# EAGLE design xmega32A4U (EAGLE 6.5.0)
DATABASE: /Users/jmoreland/.dropbox-alt/Dropbox/eagle/JCM-Eagle/bom/PARTSDB.TXT; DRAWN: Joseph Moreland
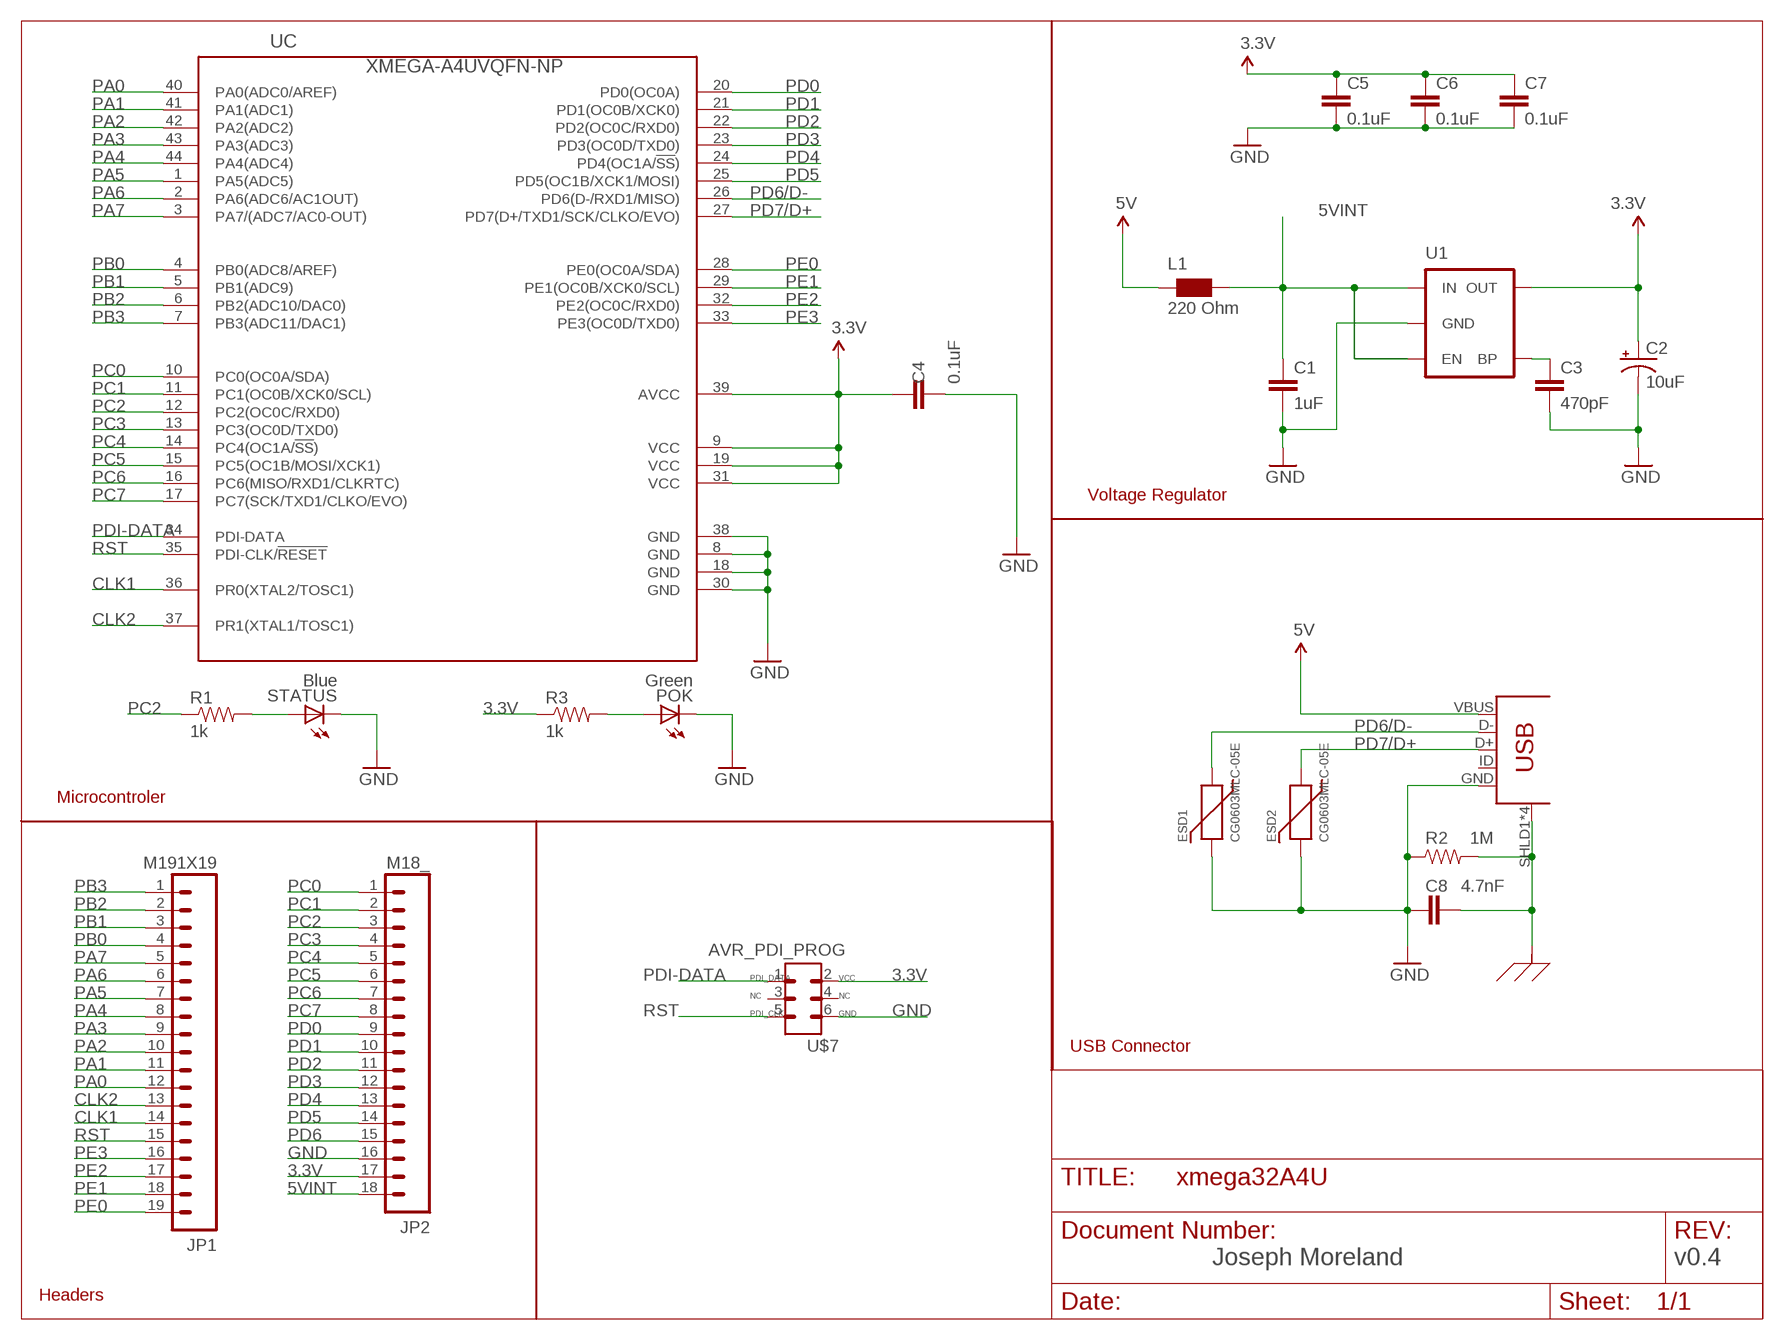
[diagram p0: schematic, sheet 1]

## Parts
C1  1uF  CAP0603-CAP  [0603-CAP]
C2  10uF  CAP_POL1206  [EIA3216]
C3  470pF  CAP0603-CAP  [0603-CAP]
C4  0.1uF  CAP0402-CAP  [0402-CAP]
C5  0.1uF  CAP0402-CAP  [0402-CAP]
C6  0.1uF  CAP0402-CAP  [0402-CAP]
C7  0.1uF  CAP0402-CAP  [0402-CAP]
C8  4.7nF  CAP0402-CAP  [0402-CAP]
ESD1  CG0603MLC-05E  CG0603MLC  [0603-CHIPGUARD]
ESD2  CG0603MLC-05E  CG0603MLC  [0603-CHIPGUARD]
JP1  M191X19  [1X19]
JP2  M18_  [1X18]
L1  220 Ohm  WE-CBF_0603  [0603]
POK  Green  LED0603  [LED-0603]
R1  1k  RESISTOR0603-RES  [0603-RES]
R2  1M  RESISTOR0402-RES  [0402-RES]
R3  1k  RESISTOR0603-RES  [0603-RES]
STATUS  Blue  LED0603  [LED-0603]
U1  V_REG_MIC52193.3V  [SOT23-5]
U$4  USB-MINIB  [USB-MINI-B-UX60-MB-5S8]
U$7  AVR_PDI_PROG  [AVR_50MIL_PROG]
UC  XMEGA-A4UVQFN-NP  [QFN44-NOPAD]

## Nets
3.3V: C2.A(+) C4.1 C5.1 C6.1 C7.1 JP2.17 R3.1 U1.5(OUT) U$7.2(VCC) UC.9(VCC) UC.19(VCC) UC.31(VCC) UC.39(AVCC)
5V: L1.1 U$4.VBUS
5VINT: C1.1 JP2.18 L1.2 U1.1(IN) U1.3(EN)
CLK1: JP1.14 UC.36(PR0(XTAL2/TOSC1))
CLK2: JP1.13 UC.37(PR1(XTAL1/TOSC1))
GND: C1.2 C2.C(-) C3.2 C4.2 C5.2 C6.2 C7.2 C8.1 ESD1.P$1 ESD2.P$1 JP2.16 POK.C R2.1 STATUS.C U1.2(GND) U$4.GND U$7.6(GND) UC.8(GND) UC.18(GND) UC.30(GND) UC.38(GND)
N$1: POK.A R3.2
N$2: R1.2 STATUS.A
N$3: C3.1 U1.4(BP)
PA0: JP1.12 UC.40(PA0(ADC0/AREF))
PA1: JP1.11 UC.41(PA1(ADC1))
PA2: JP1.10 UC.42(PA2(ADC2))
PA3: JP1.9 UC.43(PA3(ADC3))
PA4: JP1.8 UC.44(PA4(ADC4))
PA5: JP1.7 UC.1(PA5(ADC5))
PA6: JP1.6 UC.2(PA6(ADC6/AC1OUT))
PA7: JP1.5 UC.3(PA7/(ADC7/AC0-OUT))
PB0: JP1.4 UC.4(PB0(ADC8/AREF))
PB1: JP1.3 UC.5(PB1(ADC9))
PB2: JP1.2 UC.6(PB2(ADC10/DAC0))
PB3: JP1.1 UC.7(PB3(ADC11/DAC1))
PC0: JP2.1 UC.10(PC0(OC0A/SDA))
PC1: JP2.2 UC.11(PC1(OC0B/XCK0/SCL))
PC2: JP2.3 R1.1 UC.12(PC2(OC0C/RXD0))
PC3: JP2.4 UC.13(PC3(OC0D/TXD0))
PC4: JP2.5 UC.14(PC4(OC1A/!SS!))
PC5: JP2.6 UC.15(PC5(OC1B/MOSI/XCK1))
PC6: JP2.7 UC.16(PC6(MISO/RXD1/CLKRTC))
PC7: JP2.8 UC.17(PC7(SCK/TXD1/CLKO/EVO))
PD0: JP2.9 UC.20(PD0(OC0A))
PD1: JP2.10 UC.21(PD1(OC0B/XCK0))
PD2: JP2.11 UC.22(PD2(OC0C/RXD0))
PD3: JP2.12 UC.23(PD3(OC0D/TXD0))
PD4: JP2.13 UC.24(PD4(OC1A/!SS!))
PD5: JP2.14 UC.25(PD5(OC1B/XCK1/MOSI))
PD6: JP2.15
PD6/D-: ESD1.P$2 U$4.D- UC.26(PD6(D-/RXD1/MISO))
PD7/D+: ESD2.P$2 U$4.D+ UC.27(PD7(D+/TXD1/SCK/CLKO/EVO))
PDI-DATA: U$7.1(PDI_DATA) UC.34(PDI-DATA)
PE0: JP1.19 UC.28(PE0(OC0A/SDA))
PE1: JP1.18 UC.29(PE1(OC0B/XCK0/SCL))
PE2: JP1.17 UC.32(PE2(OC0C/RXD0))
PE3: JP1.16 UC.33(PE3(OC0D/TXD0))
RST: JP1.15 U$7.5(PDI_CLK) UC.35(PDI-CLK/!RESET)
SHLD: C8.2 R2.2 U$4.SHLD1(SHLD) U$4.SHLD2(SHLD) U$4.SHLD3(SHLD) U$4.SHLD4(SHLD) ; supply symbol labelled GND_EARTH
Unconnected: U$4.ID U$7.3(NC) U$7.4(NC1)

## Notes on the sheet
- Voltage Regulator
- Microcontroler
- USB Connector
- Joseph Moreland | v0.4
- Headers

## Library data of the parts
C1 = JCM-Capacitors:CAP: Capacitor Standard 0603 ceramic capacitor, and 0.1" leaded capacitor.; PARTNO: C0603C105K3PACTU
C2 = SparkFun-Capacitors:CAP_POL: Capacitor Polarized These are standard SMD and PTH capacitors. Normally 10uF, 47uF, and 100uF in electrolytic and tantalum varieties. Always verify the external diameter of the through hole cap, it varies with capacity, voltage, and manufacturer. The EIA devices should be standard.; PARTNO: T494A106M020AT
C3 = JCM-Capacitors:CAP: Capacitor Standard 0603 ceramic capacitor, and 0.1" leaded capacitor.; PARTNO: C0603C471K5RACTU
C4-C7 = JCM-Capacitors:CAP: Capacitor Standard 0603 ceramic capacitor, and 0.1" leaded capacitor.; PARTNO: GMK105BJ104KV-F
C8 = JCM-Capacitors:CAP: Capacitor Standard 0603 ceramic capacitor, and 0.1" leaded capacitor.; PARTNO: C0402C472K3RACTU
ESD1 ESD2 = JCM:CG0603MLC: ESD suppresor ChipGuard MLC; PARTNO: CG0603MLC-05E
JP1 = SparkFun-Connectors:M19: 1x19 .1" header; PARTNO: M20-9732046
JP2 = SparkFun-Connectors:M18: 1x18 .1" header; PARTNO: 68000-418HLF
L1 = wuerth-elektronik:WE-CBF: SMD EMI Suppression Ferrite Beads - excellent anti-EMI properties - low DCR - impedances till 3000 ohms - rated current up to 6 A; PARTNO: MPZ1608S221A
POK = SparkFun-LED:LED: LEDs Standard schematic elements and footprints for 5mm, 3mm, 1206, and 0603 sized LEDs. 5mm - Spark Fun Electronics SKU : COM-00529 (and others); PARTNO: LTST-C190KGKT
R1 R3 = JCM-Resistors:RESISTOR: Resistor Basic schematic elements and footprints for 0603, 1206, and PTH resistors.; PARTNO: RC0603FR-071KL
R2 = JCM-Resistors:RESISTOR: Resistor Basic schematic elements and footprints for 0603, 1206, and PTH resistors.; PARTNO: CRCW04021M00JNED
STATUS = SparkFun-LED:LED: LEDs Standard schematic elements and footprints for 5mm, 3mm, 1206, and 0603 sized LEDs. 5mm - Spark Fun Electronics SKU : COM-00529 (and others); PARTNO: LTST-C191TBKT
U1 = SparkFun-PowerIC:V_REG_MIC5219: V_REG MIC5219 Standard 500mA LDO voltage regulator in SOT-23 layout. Micrel part MIC5219. BP (by-pass) pin is used to lower output noise with 470pF cap, may be left open.; PARTNO: MIC5219-3.3YM5 TR; PROD_ID: VREG-09872; VALUE: MIC5219 3.3V
U$4 = JCM-Connectors:USB-MINIB: Mini-USB "B" connector with 5th pin broken out. Created new symbol breaking out 5th "ID" pin in mini/micro USB connector spec. See: http://en.wikipedia.org/wiki/Mini_usb#Cables. Uses same footprint as 4-pin symbol. Also added pins to connect to mounting / shield pads if required (probably not generally needed as signals aren't shielded once they leave the connector).; PARTNO: UX60-MB-5S8
U$7 = JCM-Connectors:AVR_PDI_PROG; PARTNO: LPPB032NFSP-RC
UC = JCM-IC:XMEGA-A4U: Atmel XMega A4 series processor; PARTNO: ATXMEGA32A4U-MH

## Net classes
0 default: width 0.203 mm, drill 0.305 mm, clearance 0.203 mm

## Board
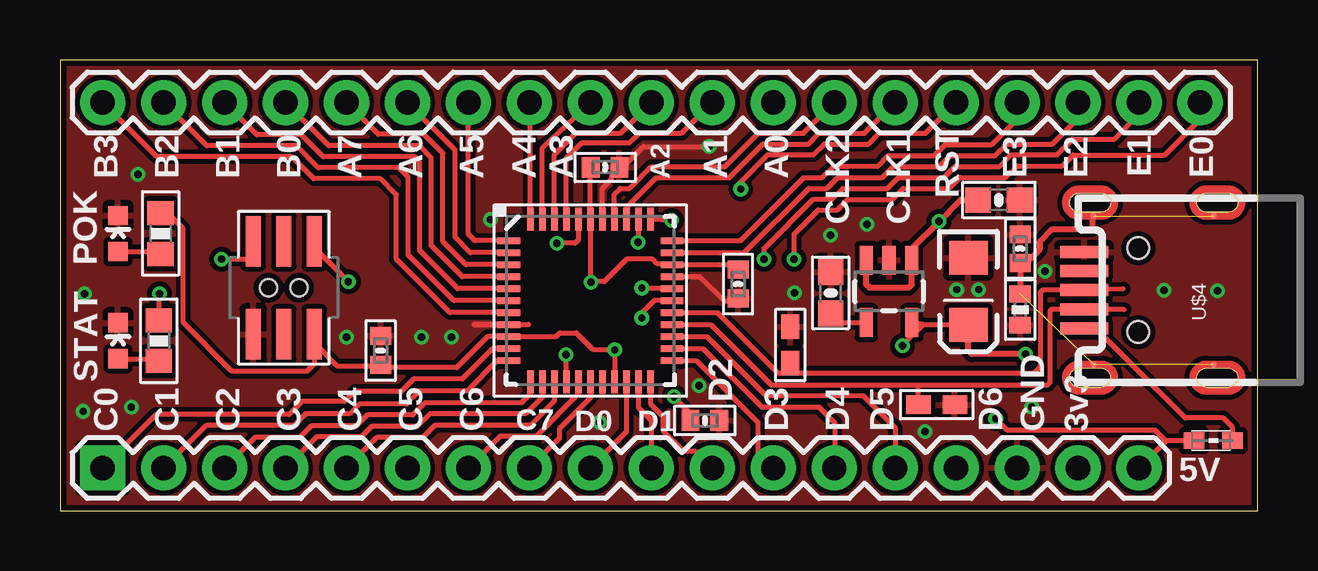
[diagram p1: board, top side]
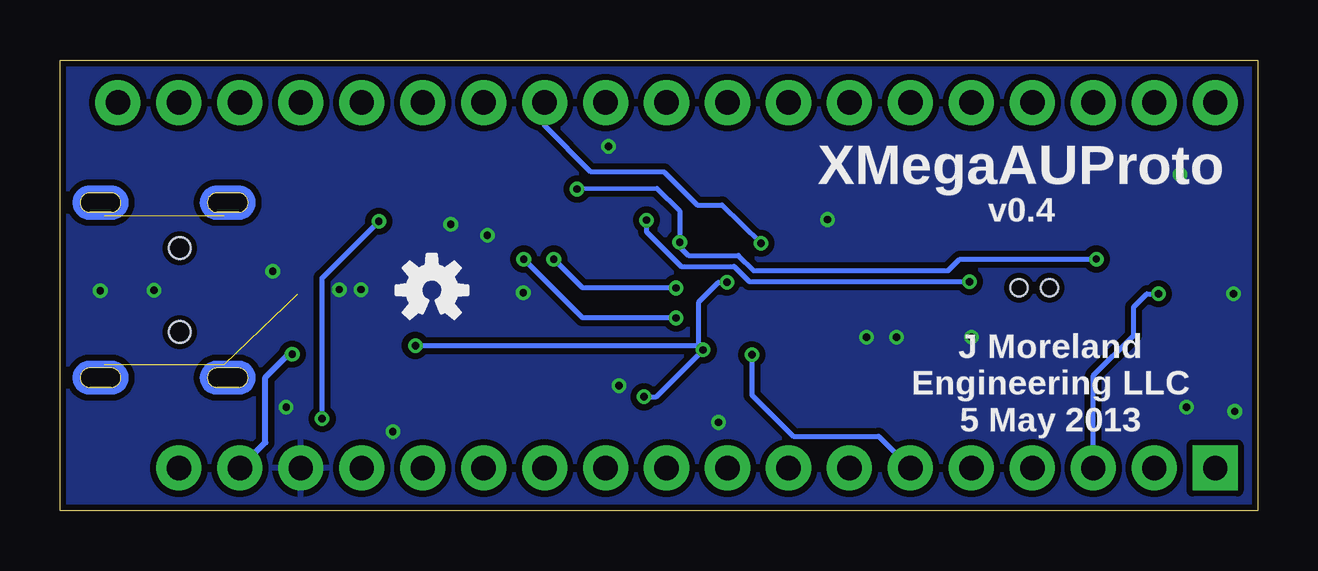
[diagram p2: board, bottom side, seen from below]

Size 49.91 x 18.8 mm. Coordinates in mm from the lower left corner, seen from the top.
Outline: 0,0 49.91,0 49.91,18.8 0,18.8 0,0
Copper layers (1*16): Top 0.035mm / dielectric 1.5mm / Bottom 0.035mm
Design rules "Fusion_eagle_rule_v1.1 *": minimum track width 6mil, minimum drill 12mil, track to track 6mil, track to pad 6mil, pad to pad 6mil, via to via 6mil, smd to smd 0mil, copper to edge 10mil, drill to drill 10mil, minimum pad ring 10mil, minimum via ring 6mil, stop-mask expansion 2mil, vias tented up to drill 100mil, thermal gap 10mil

### Footprints (pad centres in the part's own frame; a part is rotated, then mirrored left to right if it is on the bottom)
0603-CAP = smd 1.08 x 1.05: 1 -0.865,0; 2 0.865,0
EIA3216 = smd 1.4 x 1.6: A 1.4,0; C -1.4,0
0402-CAP = smd 0.74 x 0.87: 1 -0.6,0; 2 0.6,0
0603-CHIPGUARD = smd 1.02 x 0.76: P$1 -0.76,0; P$2 0.76,0
1X19 = drill 1.016 pad 1.88: 1 0,0; 2 2.54,0; 3 5.08,0; 4 7.62,0; 5 10.16,0; 6 12.7,0; 7 15.24,0; 8 17.78,0; 9 20.32,0; 10 22.86,0; 11 25.4,0; 12 27.94,0; 13 30.48,0; 14 33.02,0; 15 35.56,0; 16 38.1,0; 17 40.64,0; 18 43.18,0; 19 45.72,0
1X18 = drill 1.016 pad 1.88 square: 1 0,0 | drill 1.016 pad 1.88: 2 2.54,0; 3 5.08,0; 4 7.62,0; 5 10.16,0; 6 12.7,0; 7 15.24,0; 8 17.78,0; 9 20.32,0; 10 22.86,0; 11 25.4,0; 12 27.94,0; 13 30.48,0; 14 33.02,0; 15 35.56,0; 16 38.1,0; 17 40.64,0; 18 43.18,0
0603 = smd 0.85 x 0.7: 1 -0.9,0; 2 0.7,0
LED-0603 = smd 0.8 x 0.8: A 0,-0.75; C 0,0.75
0603-RES = smd 1 x 1.1: 1 -0.85,0; 2 0.85,0
0402-RES = smd 0.7 x 0.9: 1 -0.65,0; 2 0.65,0
SOT23-5 = smd 0.55 x 1.2: 1 -0.95,-1.3; 2 0,-1.3; 3 0.95,-1.3; 4 0.95,1.3; 5 -0.95,1.3
USB-MINI-B-UX60-MB-5S8 = smd 0.5 x 2: D+ 0,0; D- -0.8,0; GND 1.6,0; ID 0.8,0; VBUS -1.6,0 | smd 0.25 x 0.25: SHLD1 -3.1,-0.4; SHLD2 3.1,-0.4; SHLD3 3.1,-5.4; SHLD4 -3.1,-5.4 | hole 0.9: -1.75,-2.25; 1.75,-2.25
AVR_50MIL_PROG = smd 2.108 x 0.635: 1 -1.943,1.27; 2 1.943,1.27; 3 -1.943,0; 4 1.943,0; 5 -1.943,-1.27; 6 1.943,-1.27 | hole 0.711: 0,0.635; 0,-0.635
QFN44-NOPAD = smd 0.95 x 0.27: 1 -3.4,2.5; 2 -3.4,2; 3 -3.4,1.5; 4 -3.4,1; 5 -3.4,0.5; 6 -3.4,0; 7 -3.4,-0.5; 8 -3.4,-1; 9 -3.4,-1.5; 10 -3.4,-2; 11 -3.4,-2.5; 23 3.4,-2.5; 24 3.4,-2; 25 3.4,-1.5; 26 3.4,-1; 27 3.4,-0.5; 28 3.4,0; 29 3.4,0.5; 30 3.4,1; 31 3.4,1.5; 32 3.4,2; 33 3.4,2.5 | smd 0.27 x 0.95: 12 -2.5,-3.4; 13 -2,-3.4; 14 -1.5,-3.4; 15 -1,-3.4; 16 -0.5,-3.4; 17 0,-3.4; 18 0.5,-3.4; 19 1,-3.4; 20 1.5,-3.4; 21 2,-3.4; 22 2.5,-3.4; 34 2.5,3.4; 35 2,3.4; 36 1.5,3.4; 37 1,3.4; 38 0.5,3.4; 39 0,3.4; 40 -0.5,3.4; 41 -1,3.4; 42 -1.5,3.4; 43 -2,3.4; 44 -2.5,3.4

### Placement (x,y rotation side)
C1  39.12,12.95 0 top
C2  37.85,9.14 270 top
C3  32.11,9.08 90 top
C4  13.36,6.68 90 top
C5  28.25,9.45 270 top
C6  22.71,14.32 0 top
C7  26.87,3.76 0 top
C8  40.01,10.92 270 top
ESD1  36.53,4.42 180 top
ESD2  30.43,6.91 270 top
JP1  1.78,17.02 0 top
JP2  1.78,1.78 0 top
L1  47.96,2.92 180 top
POK  2.41,11.56 0 top
R1  4.11,7.09 270 top
R2  40.01,8.38 90 top
R3  4.19,11.56 270 top
STATUS  2.41,7.09 0 top
U1  34.54,9.14 180 top
U$4  42.67,9.19 90 top
U$6  [OSHW-LOGO-S]  34.42,9.19 0 bottom
U$7  9.32,9.3 270 top
UC  22.1,8.76 0 top

### Tracks (layer width: path | path; a pad name or v marks a point on that pad's centre or on a via)
3.3V  (via drill 0.3)
  Top 0.203: C5.1 27.96,10.26 UC.31 25.53,10.29 24.89,10.29 24.69,10.49 23.62,10.49 22.68,9.55 22.15,9.55 v22.12,9.53 22.12,12.19 UC.39 22.1,14.28 C6.1 | UC.19 23.11,5.33 v23.11,6.71 23.09,6.73 22.2,6.73 21.51,7.42 20.83,7.42 20.67,7.26 UC.9 17.83,7.26 16.54,5.97 13.68,5.97 C4.1 13.34,6.04 11.53,6.04 10.59,6.98 U$7.2 10.59,6.12 10.29,5.82 7.16,5.82 5.13,7.85 5.13,11.76 4.48,12.41 R3.1 | C7.1 26.22,4.1 v25.58,4.75 | C2.A 36.1,7.74 | 36.1,7.74 U1.5 | 36.1,7.74 35.96,7.74 v35.1,6.88
  Top 0.254: v40.23,6.53 38,6.53 37.85,6.68 C2.A
  Bottom 0.203: v35.1,6.88 23.29,6.88 | 23.29,6.88 v23.11,6.71 25.07,4.75 v25.58,4.75 | 23.29,6.88 23.29,8.71 22.48,9.53 v22.12,9.53
  Bottom 0.254: JP2.17 41.35,2.85 41.35,5.56 40.39,6.53 v40.23,6.53
5V
  Top 0.203: L1.1 48.85,3.47 48.46,3.86 46.89,3.86 43.15,7.59 U$4.VBUS
5VINT  (via drill 0.3)
  Top 0.203: 46.08,2.92 L1.2 | 46.08,2.92 45.64,3.35 39.47,3.35 v38.99,3.84 | JP2.18 46.08,2.9 46.08,2.92 | C1.1 38.23,12.95
  Top 0.254: U1.3 33.58,10.43 33.58,9.45 33.73,9.3 35.36,9.3 35.49,9.43 U1.1 35.49,10.93 v36.63,12.06 37.52,12.95 C1.1
  Bottom 0.203: 38.48,10.21 v36.63,12.06 38.99,9.7 v38.99,3.84
CLK1
  Top 0.203: UC.36 23.6,12.65 24.84,13.89 27.89,13.89 29.29,15.29 31.19,15.29 31.64,15.74 33.52,15.74 JP1.14
CLK2
  Top 0.203: UC.37 23.1,13.2 23.34,13.44 23.74,13.44 24.64,14.34 27.69,14.34 29.09,15.74 30.98,15.74 JP1.13
GND  (via drill 0.3)
  Top 0.203: UC.30 26.66,9.76 27.69,8.74 28.19,8.74 C5.2 | UC.38 22.6,13.43 22.99,13.82 22.99,13.95 C6.2 23.44,14.32 24.31,15.19 v27.05,15.19 | UC.8 17.26,7.76 17.25,7.77 19.51,7.77 19.52,7.76
  other vias: 32.11,11.48 41.05,9.98 22.48,3.68 26.62,5.21 17.93,12.14 11.94,7.24 40.49,4.32 15.06,7.24 16.31,7.24 48.23,9.17 1.02,9.04 33.63,11.94 38.28,9.22 30.61,9.09 0.97,4.14 2.97,4.32 3.25,14.02 36.04,3.3 37.36,9.22 46,9.19
  pour Top: 0,18.8 49.91,18.8 49.91,0 0,0
  pour Bottom (isolate 0.254): -2.03,19.05 51.82,19.05 51.82,-0.76 -2.03,-0.76
N$1
  Top 0.203: POK.A 4.09,10.81 R3.2
N$2
  Top 0.203: STATUS.A 4.02,6.34 R1.2
N$3
  Top 0.203: C3.1 32.5,7.84 U1.4
PA0  (via drill 0.3)
  Top 0.203: 21.6,12.02 21.6,11.67 | UC.40 21.6,12.02 | 21.6,12.02 21.59,12.01 21.59,11.28 21.46,11.15 v20.7,11.15
  Bottom 0.203: JP1.12 29.72,16.05 27.79,14.12 24.74,14.12 23.37,12.75 22.33,12.75 v20.7,11.15
PA1
  Top 0.203: UC.41 21.1,14.7 21.74,15.34 23.72,15.34 24.13,15.75 25.91,15.75 JP1.11
PA2
  Top 0.203: UC.42 20.6,14.86 21.49,15.75 23.37,15.75 JP1.10
PA3
  Top 0.203: UC.43 20.1,15.14 JP1.9
PA4
  Top 0.203: UC.44 19.6,16.85 JP1.8
PA5
  Top 0.203: UC.1 17.29,11.26 17.02,11.53 JP1.7
PA6
  Top 0.203: UC.2 17.1,10.76 16.46,11.4 16.46,15.04 JP1.6
PA7
  Top 0.203: UC.3 16.91,10.26 15.95,11.23 15.95,14.91 15.16,15.7 13.26,15.7 JP1.5
PB0
  Top 0.203: UC.4 16.75,9.76 15.47,11.05 15.47,14.73 14.99,15.21 11.2,15.21 JP1.4
PB1
  Top 0.203: UC.5 16.57,9.26 14.99,10.85 14.99,14.55 14.78,14.76 10.97,14.76 10.06,15.67 8.2,15.67 JP1.3
PB2
  Top 0.203: UC.6 16.41,8.76 14.5,10.67 14.5,13.92 14.12,14.3 10.77,14.3 9.86,15.21 6.12,15.21 JP1.2
PB3
  Top 0.203: UC.7 16.25,8.26 14.02,10.49 14.02,13.18 13.36,13.84 10.57,13.84 9.65,14.76 4.04,14.76 JP1.1
PC0
  Top 0.203: UC.10 18.04,6.76 16.76,5.49 14.73,5.49 14.22,4.98 12.29,4.98 11.86,4.55 10.08,4.55 9.55,4.01 4.01,4.01 JP2.1
PC1
  Top 0.203: UC.11 18.23,6.26 16.97,5 14.99,5 14.43,4.45 12.47,4.45 12.06,4.04 10.24,4.04 9.75,3.56 6.1,3.56 JP2.2
PC2  (via drill 0.3)
  Top 0.203: UC.12 19.6,4.87 19.23,4.5 15.21,4.5 14.71,3.99 12.8,3.99 12.34,3.53 10.46,3.53 9.98,3.05 8.13,3.05 JP2.3 | v4.14,9.04 4.12,9.02 R1.1
  Bottom 0.203: JP2.3 6.86,5.64 5.18,7.31 5.18,8.48 4.62,9.04 v4.14,9.04
PC3
  Top 0.203: UC.13 20.1,4.73 19.41,4.04 15.42,4.04 14.88,3.51 12.98,3.51 12.55,3.07 10.69,3.07 JP2.4
PC4
  Top 0.203: UC.14 20.6,4.57 19.58,3.56 15.62,3.56 15.11,3.05 13.21,3.05 JP2.5
PC5  (via drill 0.3)
  Top 0.203: UC.15 21.1,6.49 v21.08,6.5
  Bottom 0.203: v21.08,6.5 21.08,4.83 19.36,3.1 15.8,3.1 JP2.6
PC6
  Top 0.203: UC.16 21.6,4.86 19.84,3.1 18.34,3.1 JP2.7
PC7
  Top 0.203: UC.17 22.1,4.7 20.8,3.4 20.8,3.02 JP2.8
PD0
  Top 0.203: UC.20 23.6,3.28 JP2.9
PD1
  Top 0.203: UC.21 24.1,4.3 24.64,3.76 JP2.10
PD2
  Top 0.203: UC.22 24.6,4.46 25.12,3.94 25.12,3.35 25.98,2.49 26.47,2.49 JP2.11
PD3
  Top 0.203: UC.23 26.5,6.26 29.08,3.68 29.08,2.41 JP2.12
PD4
  Top 0.203: UC.24 26.79,6.76 29.23,4.32 31.62,4.32 32.28,3.66 32.28,1.8 JP2.13
PD5
  Top 0.203: UC.25 26.95,7.26 29.41,4.8 33.45,4.8 34.8,3.45 JP2.14
PD6/D-
  Top 0.203: UC.26 27.11,7.76 29.64,5.24 35.76,5.24 | 35.76,5.24 41.15,5.24 41.25,5.34 41.25,8.33 41.31,8.39 U$4.D- 44.34,8.38 | ESD1.P$2 35.77,5.24 35.76,5.24
PD7/D+
  Top 0.203: UC.27 27.39,8.26 29.91,5.74 30.43,5.74 | 30.43,5.74 40.59,5.74 | 40.59,5.74 40.69,5.74 | 44.3,9.25 U$4.D+ 40.95,9.2 40.84,9.09 40.84,5.99 40.59,5.74 | ESD2.P$2 30.43,5.74
PDI-DATA  (via drill 0.3)
  Top 0.203: UC.34 v25.47,12.11 v25.48,12.12 | v12.01,9.55 10.59,10.97 U$7.1
  Bottom 0.203: v25.48,12.12 25.48,11.63 24.03,10.18 21.82,10.18 21.18,9.55 v12.01,9.55
PE0  (via drill 0.3)
  Top 0.203: UC.28 24.76,8.76 24.24,8.24 v24.24,8.04 | v30.59,10.49 30.59,11.54 31.59,12.54 32.38,12.54 32.82,12.98 34.67,12.98 35.13,13.44 37.03,13.44 37.49,13.89 39.39,13.89 39.88,14.38 41.76,14.38 42.21,14.83 46.02,14.83 47.5,16.31 JP1.19
  Bottom 0.203: v24.24,8.04 28.14,8.04 v30.59,10.49
PE1  (via drill 0.3)
  Top 0.203: UC.29 24.26,9.26 v24.24,9.29 | v29.34,10.49 29.34,10.94 31.39,12.99 32.16,12.99 32.61,13.44 34.47,13.44 34.92,13.89 36.83,13.89 37.29,14.35 39.15,14.35 39.64,14.84 41.54,14.84 42.19,15.49 43.94,15.49 44.96,16.51 JP1.18
  Bottom 0.203: v24.24,9.29 28.14,9.29 v29.34,10.49
PE2
  Top 0.203: UC.32 28.51,10.76 31.19,13.44 31.95,13.44 32.41,13.89 34.27,13.89 34.72,14.35 36.63,14.35 37.08,14.81 38.96,14.81 39.44,15.29 41.34,15.29 42.42,16.37 JP1.17
PE3
  Top 0.203: UC.33 28.36,11.26 30.99,13.89 31.74,13.89 32.23,14.38 34.09,14.38 34.52,14.81 36.42,14.81 36.88,15.27 38.81,15.27 39.88,16.33 JP1.16
RST  (via drill 0.3)
  Top 0.203: UC.35 v24.1,11.2 v24.09,11.19 | v28.36,13.41 28.34,13.69 29.49,14.84 31.39,14.84 31.84,15.29 33.69,15.29 34.14,15.74 36.06,15.74 JP1.15 | 8.05,11.12 U$7.5 8.05,10.52 8.03,10.49 v6.73,10.49
  Bottom 0.203: v24.09,11.19 24.09,11.22 | v28.36,13.41 25.04,13.44 24.09,12.49 24.09,11.22 | 24.09,11.22 24.11,11.2 24.11,11.02 23.72,10.64 21.64,10.64 21.01,10.01 12.9,10.01 12.42,10.49 v6.73,10.49
SHLD  (3 unrouted)
  Top 0.203: 40.4,10.47 C8.2
  Top 0.254: C8.2 R2.2 | U$4.SHLD2 43.03,12.25 43.03,11.79 42.98,11.73 41.35,11.73 40.82,11.2 40.82,10.9 40.4,10.47

### Text on the board
tPlace: B3 | B2 | B1 | B0 | A7 | A6 | A5 | A4 | A3 | A2 | A1 | A0 | E3 | E2 | E1 | E0 | RST | CLK2 | CLK1 | POK | STAT | D2 | C0 | C1 | C2 | C3 | C4 | C5 | C6 | C7 | D0 | D1 | D3 | D4 | D5 | D6 | GND | 3v3 | 5V
bPlace: XMegaAUProto | v0.4 | J Moreland / Engineering LLC / 5 May 2013